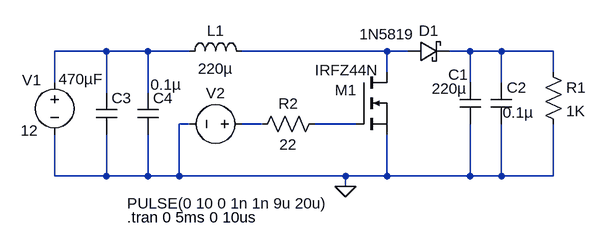
[diagram p0: schematic boost_no_fb.asc]
boost_no_fb.asc, the LTspice schematic file:
Version 4.1
SHEET 1 880 680
WIRE -64 96 -144 96
WIRE 0 96 -64 96
WIRE 64 96 0 96
WIRE 368 96 144 96
WIRE 400 96 368 96
WIRE 496 96 464 96
WIRE 544 96 496 96
WIRE 624 96 544 96
WIRE 368 128 368 96
WIRE 624 128 624 96
WIRE -144 144 -144 96
WIRE 496 144 496 96
WIRE 544 144 544 96
WIRE -64 160 -64 96
WIRE 0 160 0 96
WIRE 64 208 48 208
WIRE 176 208 144 208
WIRE 320 208 256 208
WIRE -144 288 -144 224
WIRE -64 288 -64 224
WIRE -64 288 -144 288
WIRE 0 288 0 224
WIRE 0 288 -64 288
WIRE 48 288 48 208
WIRE 48 288 0 288
WIRE 304 288 48 288
WIRE 368 288 368 224
WIRE 368 288 304 288
WIRE 496 288 496 208
WIRE 496 288 368 288
WIRE 544 288 544 208
WIRE 544 288 496 288
WIRE 624 288 624 208
WIRE 624 288 544 288
WIRE 304 304 304 288
FLAG 304 304 0
SYMBOL voltage -144 128 R0
WINDOW 0 -50 12 Left 2
WINDOW 3 -52 90 Left 2
WINDOW 123 0 0 Left 0
WINDOW 39 0 0 Left 0
SYMATTR InstName V1
SYMATTR Value 12
SYMBOL nmos 320 128 R0
WINDOW 0 -32 28 Left 2
WINDOW 3 -63 -3 Left 2
SYMATTR InstName M1
SYMATTR Value IRFZ44N
SYMBOL ind 48 112 R270
WINDOW 0 32 56 VTop 2
WINDOW 3 5 56 VBottom 2
SYMATTR InstName L1
SYMATTR Value 220µ
SYMATTR SpiceLine Rser=0.2
SYMBOL cap 480 144 R0
WINDOW 0 -18 -12 Left 2
WINDOW 3 -43 9 Left 2
SYMATTR InstName C1
SYMATTR Value 220µ
SYMBOL voltage 160 208 R90
WINDOW 0 -32 56 VBottom 2
WINDOW 3 107 37 VTop 2
WINDOW 123 0 0 Left 0
WINDOW 39 0 0 Left 0
SYMATTR InstName V2
SYMATTR Value PULSE(0 10 0 1n 1n 9u 20u)
SYMBOL res 608 112 R0
SYMATTR InstName R1
SYMATTR Value 1K
SYMBOL schottky 400 112 R270
WINDOW 0 32 32 VTop 2
WINDOW 3 58 -32 VBottom 2
SYMATTR InstName D1
SYMATTR Value 1N5819
SYMBOL res 272 192 R90
WINDOW 0 0 56 VBottom 2
WINDOW 3 32 56 VTop 2
SYMATTR InstName R2
SYMATTR Value 22
SYMBOL cap 528 144 R0
WINDOW 3 18 46 Left 2
SYMATTR Value 0.1µ
SYMATTR InstName C2
SYMBOL cap -80 160 R0
WINDOW 3 -58 -21 Left 2
SYMATTR Value 470µF
SYMATTR InstName C3
SYMBOL cap -16 160 R0
WINDOW 3 20 -13 Left 2
SYMATTR Value 0.1µ
SYMATTR InstName C4
TEXT -32 352 Left 2 !.tran 0 5ms 0 10us

The netlist it stands for:
* boost_no_fb.asc
V1 N001 0 12
M1 N002 N005 0 0 IRFZ44N
L1 N001 N002 220µ Rser=0.2
C1 N003 0 220µ
V2 N004 0 PULSE(0 10 0 1n 1n 9u 20u)
R1 N003 0 1K
D1 N002 N003 1N5819
R2 N005 N004 22
C2 N003 0 0.1µ
C3 N001 0 470µF
C4 N001 0 0.1µ
.model D D
.lib standard.dio
.model NMOS NMOS
.model PMOS PMOS
.lib standard.mos
.tran 0 5ms 0 10us
.backanno
.end